# Altium project Hydra A1 UCLO 35131D.PrjPCB (part 5 of 14)
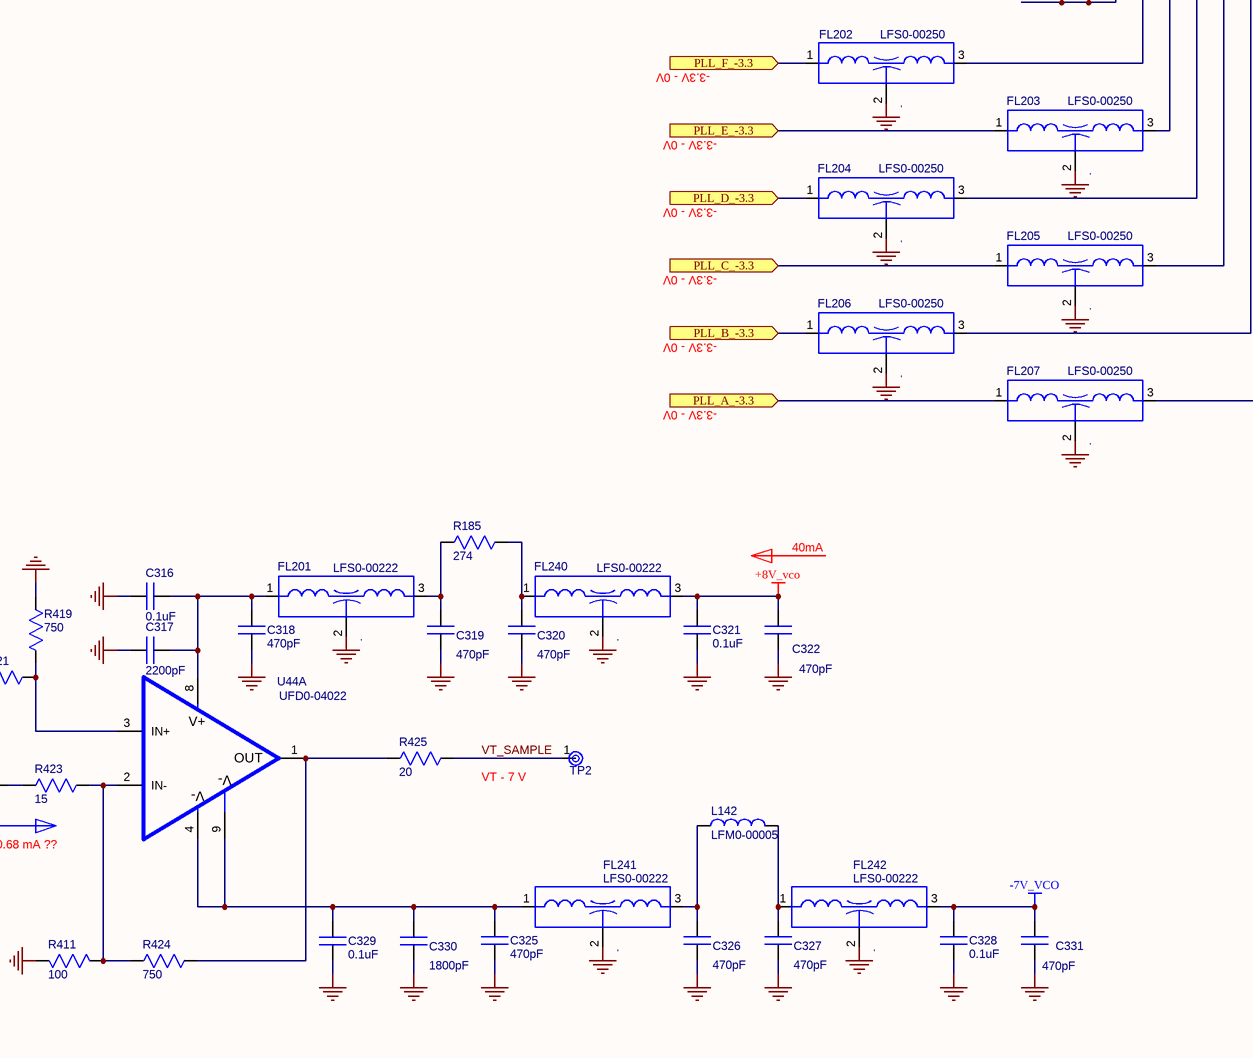
[diagram p72: Fast PLL.SchDoc, bottom right]

## Sheet Fast PLL.SchDoc: Fast PLL (continued)

### Parts
(Parts that share a designator on the sheet are numbered #1, #2 ... from top to bottom, then left to right.)
AT20  value 0dB  [ATTN-IMS-0805]  (hidden comment: PAD;CHIP;0dB;+/-.3dB;.08 x .05;50 OHM;FACE DOWN)
AT21  value 20dB  [PCAAW]  (hidden comment: PAD;CHIP;20dB;+.5/-4dB;.08 x .06;50 OHM;FACE DOWN)
C22  value 470pF  [CAP-0201-N]  (hidden comment: 470 PF,+/-5%;X7R;25V,CHIP;0201)
C23  value 470pF  [CAP-0402-N]  (hidden comment: 470 PF;5%;COG;>50V;CHIP;0402)
C26  value 470pF  [CAP-0402-N]  (hidden comment: 470 PF;5%;COG;>50V;CHIP;0402)
C27  value 0.1uF  [CAP-0402-N]  (hidden comment: .1 UF,10%;X7R;16V,CHIP;0402)
C30  value 470pF  [CAP-0402-N]  (hidden comment: 470 PF;5%;COG;>50V;CHIP;0402)
C31  value 470pF  [CAP-0402-N]  (hidden comment: 470 PF;5%;COG;>50V;CHIP;0402)
C32  value 470pF  [CAP-0402-N]  (hidden comment: 470 PF;5%;COG;>50V;CHIP;0402)
C33  value 1.5pF  [CAP-0402-RF]  (hidden comment: 1.5 PF;200V;.05PF;HIGH Q;SMT;CERAMIC;0402)
C34  value 1.8pF  [CAP-0402-RF]  (hidden comment: 1.8 PF;200V;.05PF;HIGH Q;SMT;CERAMIC;0402)
C35  value 8.2pF  [CAP-0402-RF]  (hidden comment: 8.2 PF;200V;.1PF;HIGH Q;SMT;CERAMIC;0402)
C36  value 1.5pF  [CAP-0402-RF]  (hidden comment: 1.5 PF;200V;.05PF;HIGH Q;SMT;CERAMIC;0402)
C37  value 1.8pF  [CAP-0402-RF]  (hidden comment: 1.8 PF;200V;.05PF;HIGH Q;SMT;CERAMIC;0402)
C38  value 8.2pF  [CAP-0402-RF]  (hidden comment: 8.2 PF;200V;.1PF;HIGH Q;SMT;CERAMIC;0402)
C39  value 1.5pF  [CAP-0402-RF]  (hidden comment: 1.5 PF;200V;.05PF;HIGH Q;SMT;CERAMIC;0402)
C40  value 1.2pF  [CAP-0402-RF]  (hidden comment: 1.2 PF;200V;.05PF;HIGH Q;SMT;CERAMIC;0402)
C41  value 9.1pF  [CAP-0402-RF]  (hidden comment: 9.1 PF;200V;.1PF;HIGH Q;SMT;CERAMIC;0402)
C42  value 470pF  [CAP-0402-N]  (hidden comment: 470 PF;5%;COG;>50V;CHIP;0402)
C43  value 0.1uF  [CAP-0402-N]  (hidden comment: .1 UF,10%;X7R;16V,CHIP;0402)
C44  value 0.1uF  [CAP-0402-N]  (hidden comment: .1 UF,10%;X7R;16V,CHIP;0402)
C45  value 6.8pF  [CAP-0402-RF]  (hidden comment: 6.8 PF;200V;.1PF;HIGH Q;SMT;CERAMIC;0402)
C46  value 1.8pF  [CAP-0402-RF]  (hidden comment: 1.8 PF;200V;.05PF;HIGH Q;SMT;CERAMIC;0402)
C47  value 9.1pF  [CAP-0402-RF]  (hidden comment: 9.1 PF;200V;.1PF;HIGH Q;SMT;CERAMIC;0402)
C48  value 6.8pF  [CAP-0402-RF]  (hidden comment: 6.8 PF;200V;.1PF;HIGH Q;SMT;CERAMIC;0402)
C49  value 1.2pF  [CAP-0402-RF]  (hidden comment: 1.2 PF;200V;.05PF;HIGH Q;SMT;CERAMIC;0402)
C50  value 1.2pF  [CAP-0402-RF]  (hidden comment: 1.2 PF;200V;.05PF;HIGH Q;SMT;CERAMIC;0402)
C52  value 1.5pF  [CAP-0402-RF]  (hidden comment: 1.5 PF;200V;.05PF;HIGH Q;SMT;CERAMIC;0402)
C53  value 1.5pF  [CAP-0402-RF]  (hidden comment: 1.5 PF;200V;.05PF;HIGH Q;SMT;CERAMIC;0402)
C54  value 0.6pF  [CAP-0402-RF]  (hidden comment: .6 PF;200V;.05PF;HIGH Q;SMT;CERAMIC;0402)
C55  value 0.6pF  [CAP-0402-RF]  (hidden comment: .6 PF;200V;.05PF;HIGH Q;SMT;CERAMIC;0402)
C56  value 0.6pF  [CAP-0402-RF]  (hidden comment: .6 PF;200V;.05PF;HIGH Q;SMT;CERAMIC;0402)
C57  value 0.8pF  [CAP-0402-RF]  (hidden comment: .8 PF;200V;.05PF;HIGH Q;SMT;CERAMIC;0402)
C58  value 0.6pF  [CAP-0402-RF]  (hidden comment: .6 PF;200V;.05PF;HIGH Q;SMT;CERAMIC;0402)
C68  value 0.1uF  [CAP-0402-N]  (hidden comment: .1 UF,10%;X7R;16V,CHIP;0402)
C75  value 470pF  [CAP-0402-N]  (hidden comment: 470 PF;5%;COG;>50V;CHIP;0402)
C92  value 0.1uF  [CAP-0402-N]  (hidden comment: .1 UF,10%;X7R;16V,CHIP;0402)
C98  value 470pF  [CAP-0402-N]  (hidden comment: 470 PF;5%;COG;>50V;CHIP;0402)
C99  value 0.1uF  [CAP-0402-N]  (hidden comment: .1 UF,10%;X7R;16V,CHIP;0402)
C127  value 0.1uF  [CAP-0402-N]  (hidden comment: .1 UF,10%;X7R;16V,CHIP;0402)
C161  value 27pF  [CAP-0201-N]  (hidden comment: 27 PF,5% TOL;C0G;50V,CHIP;0201)
C163  value 27pF  [CAP-0402-N]  (hidden comment: 27 PF;5%;COG;>50V;CHIP;0402)
C167  value 0.1uF, 50V  [CAP-0603-N]  (hidden comment: .1UF;5%;X7R;50V;CHIP;0603)
C168  value 470pF  [CAP-0201-N]  (hidden comment: 470 PF,+/-5%;X7R;25V,CHIP;0201)
C169  value 0.1uF  [CAP-0402-N]  (hidden comment: .1 UF,10%;X7R;16V,CHIP;0402)
C170  value 470pF  [CAP-0402-N]  (hidden comment: 470 PF;5%;COG;>50V;CHIP;0402)
C174  value 150pF  [CAP-0402-N]  (hidden comment: 150 PF;5%;COG;>50V;CHIP;0402)
C219  value 10pF  [CAP-0402-N]  (hidden comment: 10 PF;5%;COG;>50V;CHIP;0402)
C220  value 10pF  [CAP-0402-N]  (hidden comment: 10 PF;5%;COG;>50V;CHIP;0402)
C221  value 0.1uF  [CAP-0402-N]  (hidden comment: .1 UF,10%;X7R;16V,CHIP;0402)
C223  value 470pF  [CAP-0402-N]  (hidden comment: 470 PF;5%;COG;>50V;CHIP;0402)
C224  value 470pF  [CAP-0402-N]  (hidden comment: 470 PF;5%;COG;>50V;CHIP;0402)
C225  value 0.1uF  [CAP-0402-N]  (hidden comment: .1 UF,10%;X7R;16V,CHIP;0402)
C226  value 470pF  [CAP-0402-N]  (hidden comment: 470 PF;5%;COG;>50V;CHIP;0402)
C228  value 0.1uF  [CAP-0402-N]  (hidden comment: .1 UF,10%;X7R;16V,CHIP;0402)
C229  value 470pF  [CAP-0402-N]  (hidden comment: 470 PF;5%;COG;>50V;CHIP;0402)
C242  value 0.1uF, 50V  [CAP-0603-N]  (hidden comment: .1UF;5%;X7R;50V;CHIP;0603)
C243  value 1800pF  [CAP-0402-N]  (hidden comment: 1800 PF;5%;X7R>50V;CHIP;0402)
C244  value 470pF  [CAP-0402-N]  (hidden comment: 470 PF;5%;COG;>50V;CHIP;0402)
C246  value 470pF  [CAP-0402-N]  (hidden comment: 470 PF;5%;COG;>50V;CHIP;0402)
C247  value 0.3pF  [CAP-0402-RF]  (hidden comment: .3 PF 200V .05PF HIGH Q SMT 0402)
C248  value 0.2pF  [CAP-0402-RF]  (hidden comment: .2 PF;200V;.05PF;HIGH Q;SMT;CERAMIC;0402)
C249  value 0.3pF  [CAP-0402-RF]  (hidden comment: .3 PF 200V .05PF HIGH Q SMT 0402)
C250  value 0.2pF  [CAP-0402-RF]  (hidden comment: .2 PF;200V;.05PF;HIGH Q;SMT;CERAMIC;0402)
C251  value 1.0pF  [CAP-0201-N]  (hidden comment: 1.0pF;5%;COG;50V;CHIP;0201)
C262  value 0.1uF  [CAP-0402-N]  (hidden comment: .1 UF,10%;X7R;16V,CHIP;0402)
C263  value 0.1uF, 50V  [CAP-0603-N]  (hidden comment: .1UF;5%;X7R;50V;CHIP;0603)
C264  value 470pF  [CAP-0402-N]  (hidden comment: 470 PF;5%;COG;>50V;CHIP;0402)
C265  value 1800pF  [CAP-0402-N]  (hidden comment: 1800 PF;5%;X7R>50V;CHIP;0402)
C266  value 470pF  [CAP-0201-N]  (hidden comment: 470 PF,+/-5%;X7R;25V,CHIP;0201)
C267  value 1800pF  [CAP-0402-N]  (hidden comment: 1800 PF;5%;X7R>50V;CHIP;0402)
C268  value 470pF  [CAP-0201-N]  (hidden comment: 470 PF,+/-5%;X7R;25V,CHIP;0201)
C269  value 470pF  [CAP-0402-N]  (hidden comment: 470 PF;5%;COG;>50V;CHIP;0402)
C270  value 470pF  [CAP-0402-N]  (hidden comment: 470 PF;5%;COG;>50V;CHIP;0402)
C271  value 470pF  [CAP-0402-N]  (hidden comment: 470 PF;5%;COG;>50V;CHIP;0402)
C272  value 0.1uF, 50V  [CAP-0603-N]  (hidden comment: .1UF;5%;X7R;50V;CHIP;0603)
C273  value 470pF  [CAP-0402-N]  (hidden comment: 470 PF;5%;COG;>50V;CHIP;0402)
C274  value 0.2pF  [CAP-0402-RF]  (hidden comment: .2 PF;200V;.05PF;HIGH Q;SMT;CERAMIC;0402)
C275  value 0.1uF  [CAP-0402-N]  (hidden comment: .1 UF,10%;X7R;16V,CHIP;0402)
C276  value 1800pF  [CAP-0402-N]  (hidden comment: 1800 PF;5%;X7R>50V;CHIP;0402)
C277  value 470pF  [CAP-0201-N]  (hidden comment: 470 PF,+/-5%;X7R;25V,CHIP;0201)
C278  value 470pF  [CAP-0402-N]  (hidden comment: 470 PF;5%;COG;>50V;CHIP;0402)
C279  value 27pF  [CAP-0402-N]  (hidden comment: 27 PF;5%;COG;>50V;CHIP;0402)
C280  value 470pF  [CAP-0402-N]  (hidden comment: 470 PF;5%;COG;>50V;CHIP;0402)
C281  value 0.1uF  [CAP-0402-N]  (hidden comment: .1 UF,10%;X7R;16V,CHIP;0402)
C282  value 0.2pF  [CAP-0402-RF]  (hidden comment: .2 PF;200V;.05PF;HIGH Q;SMT;CERAMIC;0402)
C283  value 0.4pF  [CAP-0402-RF]  (hidden comment: .4 PF;200V;.05PF;HIGH Q;SMT;CERAMIC;0402)
C284  value 0.2pF  [CAP-0402-RF]  (hidden comment: .2 PF;200V;.05PF;HIGH Q;SMT;CERAMIC;0402)
C285  value 0.4pF  [CAP-0402-RF]  (hidden comment: .4 PF;200V;.05PF;HIGH Q;SMT;CERAMIC;0402)
C286  value 27pF  [CAP-0402-N]  (hidden comment: 27 PF;5%;COG;>50V;CHIP;0402)
C287  value 470pF  [CAP-0402-N]  (hidden comment: 470 PF;5%;COG;>50V;CHIP;0402)
C288  value 0.1uF  [CAP-0402-N]  (hidden comment: .1 UF,10%;X7R;16V,CHIP;0402)
C289  value 470pF  [CAP-0402-N]  (hidden comment: 470 PF;5%;COG;>50V;CHIP;0402)
C290  value 470pF  [CAP-0603-N]  (hidden comment: 470 PF;5%;COG;>50V;CHIP;0603)
C291  value 470pF  [CAP-0402-N]  (hidden comment: 470 PF;5%;COG;>50V;CHIP;0402)
C292  value 0.1uF, 50V  [CAP-0603-N]  (hidden comment: .1UF;5%;X7R;50V;CHIP;0603)
C293  value 0.1uF  [CAP-0603-H035-N]  (hidden comment: .1UF;10%;X7R;16V;CHIP;0603)
C294  value 470pF  [CAP-0201-N]  (hidden comment: 470 PF,+/-5%;X7R;25V,CHIP;0201)
C295  value 1.0pF  [CAP-0201-N]  (hidden comment: 1.0pF;5%;COG;50V;CHIP;0201)
C296  value 1800pF  [CAP-0402-N]  (hidden comment: 1800 PF;5%;X7R>50V;CHIP;0402)
C297  value 0.1uF  [CAP-0402-N]  (hidden comment: .1 UF,10%;X7R;16V,CHIP;0402)
C298  value 0.1uF  [CAP-0402-N]  (hidden comment: .1 UF,10%;X7R;16V,CHIP;0402)
C299  value 470pF  [CAP-0402-N]  (hidden comment: 470 PF;5%;COG;>50V;CHIP;0402)
C300  value 470pF  [CAP-0402-N]  (hidden comment: 470 PF;5%;COG;>50V;CHIP;0402)
C302  value 470pF  [CAP-0402-N]  (hidden comment: 470 PF;5%;COG;>50V;CHIP;0402)
C303  value 470pF  [CAP-0201-N]  (hidden comment: 470 PF,+/-5%;X7R;25V,CHIP;0201)
C304  value 470pF  [CAP-0402-N]  (hidden comment: 470 PF;5%;COG;>50V;CHIP;0402)
C305  value 0.1uF, 50V  [CAP-0603-N]  (hidden comment: .1UF;5%;X7R;50V;CHIP;0603)
C306  value 0.1uF  [CAP-0402-N]  (hidden comment: .1 UF,10%;X7R;16V,CHIP;0402)
C307  value 0.1uF  [CAP-0402-N]  (hidden comment: .1 UF,10%;X7R;16V,CHIP;0402)
C308  value 2200pF  [CAP-0201-N]  (hidden comment: 2200 PF,+/-5%;X7R;25V,CHIP;0201)
C309  value 2200pF  [CAP-0201-N]  (hidden comment: 2200 PF,+/-5%;X7R;25V,CHIP;0201)
C310  value 0.1uF  [CAP-0402-N]  (hidden comment: .1 UF,10%;X7R;16V,CHIP;0402)
C311  value 0.1uF  [CAP-0402-N]  (hidden comment: .1 UF,10%;X7R;16V,CHIP;0402)
C312  value 2200pF  [CAP-0201-N]  (hidden comment: 2200 PF,+/-5%;X7R;25V,CHIP;0201)
C313  value 470pF  [CAP-0402-N]  (hidden comment: 470 PF;5%;COG;>50V;CHIP;0402)
C314  value 470pF  [CAP-0402-N]  (hidden comment: 470 PF;5%;COG;>50V;CHIP;0402)
C315  value 0.1uF  [CAP-0402-N]  (hidden comment: .1 UF,10%;X7R;16V,CHIP;0402)
C316  value 0.1uF  [CAP-0402-N]  (hidden comment: .1 UF,10%;X7R;16V,CHIP;0402)
C317  value 2200pF  [CAP-0201-N]  (hidden comment: 2200 PF,+/-5%;X7R;25V,CHIP;0201)
C318  value 470pF  [CAP-0201-N]  (hidden comment: 470 PF,+/-5%;X7R;25V,CHIP;0201)
C319  value 470pF  [CAP-0402-N]  (hidden comment: 470 PF;5%;COG;>50V;CHIP;0402)
C320  value 470pF  [CAP-0402-N]  (hidden comment: 470 PF;5%;COG;>50V;CHIP;0402)
C321  value 0.1uF  [CAP-0402-N]  (hidden comment: .1 UF,10%;X7R;16V,CHIP;0402)
C322  value 470pF  [CAP-0402-N]  (hidden comment: 470 PF;5%;COG;>50V;CHIP;0402)
C323  value 0.1uF  [CAP-0402-N]  (hidden comment: .1 UF,10%;X7R;16V,CHIP;0402)
C325  value 470pF  [CAP-0201-N]  (hidden comment: 470 PF,+/-5%;X7R;25V,CHIP;0201)
C326  value 470pF  [CAP-0402-N]  (hidden comment: 470 PF;5%;COG;>50V;CHIP;0402)
C327  value 470pF  [CAP-0402-N]  (hidden comment: 470 PF;5%;COG;>50V;CHIP;0402)
C328  value 0.1uF  [CAP-0402-N]  (hidden comment: .1 UF,10%;X7R;16V,CHIP;0402)
C329  value 0.1uF  [CAP-0402-N]  (hidden comment: .1 UF,10%;X7R;16V,CHIP;0402)
C330  value 1800pF  [CAP-0402-N]  (hidden comment: 1800 PF;5%;X7R>50V;CHIP;0402)
C331  value 470pF  [CAP-0402-N]  (hidden comment: 470 PF;5%;COG;>50V;CHIP;0402)
C332  value 8.2pF  [CAP-0402-RF]  (hidden comment: 8.2 PF;200V;.1PF;HIGH Q;SMT;CERAMIC;0402)
C333  value 1.2pF  [CAP-0402-RF]  (hidden comment: 1.2 PF;200V;.05PF;HIGH Q;SMT;CERAMIC;0402)
C334  value 6.8pF  [CAP-0402-RF]  (hidden comment: 6.8 PF;200V;.1PF;HIGH Q;SMT;CERAMIC;0402)
C335  value 1.8pF  [CAP-0402-RF]  (hidden comment: 1.8 PF;200V;.05PF;HIGH Q;SMT;CERAMIC;0402)
C336  value 8.2pF  [CAP-0402-RF]  (hidden comment: 8.2 PF;200V;.1PF;HIGH Q;SMT;CERAMIC;0402)
C337  value 1.5pF  [CAP-0402-RF]  (hidden comment: 1.5 PF;200V;.05PF;HIGH Q;SMT;CERAMIC;0402)
C338  value 0.8pF  [CAP-0402-RF]  (hidden comment: .8 PF;200V;.05PF;HIGH Q;SMT;CERAMIC;0402)
C339  value 0.6pF  [CAP-0402-RF]  (hidden comment: .6 PF;200V;.05PF;HIGH Q;SMT;CERAMIC;0402)
C362  value 0.1uF  [CAP-0402-N]  (hidden comment: .1 UF,10%;X7R;16V,CHIP;0402)
C363  value 470pF  [CAP-0402-N]  (hidden comment: 470 PF;5%;COG;>50V;CHIP;0402)
C364  value 27pF  [CAP-0201-N]  (hidden comment: 27 PF,5% TOL;C0G;50V,CHIP;0201)
C383  value 470pF  [CAP-0201-N]  (hidden comment: 470 PF,+/-5%;X7R;25V,CHIP;0201)
C384  value 470pF  [CAP-0201-N]  (hidden comment: 470 PF,+/-5%;X7R;25V,CHIP;0201)
C386  value 470pF  [CAP-0201-N]  (hidden comment: 470 PF,+/-5%;X7R;25V,CHIP;0201)
C397  value 27pF  [CAP-0201-N]  (hidden comment: 27 PF,5% TOL;C0G;50V,CHIP;0201)
C404  value 470pF  [CAP-0201-N]  (hidden comment: 470 PF,+/-5%;X7R;25V,CHIP;0201)
C405  value 470pF  [CAP-0201-N]  (hidden comment: 470 PF,+/-5%;X7R;25V,CHIP;0201)
C406  value 27pF  [CAP-0402-N]  (hidden comment: 27 PF;5%;COG;>50V;CHIP;0402)
C407  value 27pF  [CAP-0402-N]  (hidden comment: 27 PF;5%;COG;>50V;CHIP;0402)
C408  value 27pF  [CAP-0402-N]  (hidden comment: 27 PF;5%;COG;>50V;CHIP;0402)
C409  value 27pF  [CAP-0402-N]  (hidden comment: 27 PF;5%;COG;>50V;CHIP;0402)
C410  value 0.1uF, 50V  [CAP-0603-N]  (hidden comment: .1UF;5%;X7R;50V;CHIP;0603)
C411  value 0.1uF, 50V  [CAP-0603-N]  (hidden comment: .1UF;5%;X7R;50V;CHIP;0603)
C412  .  value 470pF  [CAP-0402-N]
C413  value 0.1uF, 50V  [CAP-0603-N]  (hidden comment: .1UF;5%;X7R;50V;CHIP;0603)
C414  value 470pF  [CAP-0402-N]  (hidden comment: 470 PF;5%;COG;>50V;CHIP;0402)
C415  value 470pF  [CAP-0402-N]  (hidden comment: 470 PF;5%;COG;>50V;CHIP;0402)
C416  value 0.1uF  [CAP-0603-H035-N]  (hidden comment: .1UF;10%;X7R;16V;CHIP;0603)
C417  value 470pF  [CAP-0402-N]  (hidden comment: 470 PF;5%;COG;>50V;CHIP;0402)
C418  value 27pF  [CAP-0402-N]  (hidden comment: 27 PF;5%;COG;>50V;CHIP;0402)
C442  value 470pF  [CAP-0201-N]  (hidden comment: 470 PF,+/-5%;X7R;25V,CHIP;0201)
C443  value 470pF  [CAP-0201-N]  (hidden comment: 470 PF,+/-5%;X7R;25V,CHIP;0201)
C444  value 470pF  [CAP-0201-N]  (hidden comment: 470 PF,+/-5%;X7R;25V,CHIP;0201)
C455  value 470pF  [CAP-0201-N]  (hidden comment: 470 PF,+/-5%;X7R;25V,CHIP;0201)
C456  value 470pF  [CAP-0201-N]  (hidden comment: 470 PF,+/-5%;X7R;25V,CHIP;0201)
C457  value 470pF  [CAP-0201-N]  (hidden comment: 470 PF,+/-5%;X7R;25V,CHIP;0201)
C458  value 0.1uF  [CAP-0402-N]  (hidden comment: .1 UF,10%;X7R;16V,CHIP;0402)
C459  value 0.1uF  [CAP-0402-N]  (hidden comment: .1 UF,10%;X7R;16V,CHIP;0402)
C460  value 0.1uF, 50V  [CAP-0603-N]  (hidden comment: .1UF;5%;X7R;50V;CHIP;0603)
C461  value 470pF  [CAP-0201-N]  (hidden comment: 470 PF,+/-5%;X7R;25V,CHIP;0201)
C462  value 470pF  [CAP-0402-N]  (hidden comment: 470 PF;5%;COG;>50V;CHIP;0402)
C463  value 470pF  [CAP-0402-N]  (hidden comment: 470 PF;5%;COG;>50V;CHIP;0402)
C464  value 470pF  [CAP-0402-N]  (hidden comment: 470 PF;5%;COG;>50V;CHIP;0402)
C465  value 470pF  [CAP-0402-N]  (hidden comment: 470 PF;5%;COG;>50V;CHIP;0402)
C466  value 0.1uF, 50V  [CAP-0603-N]  (hidden comment: .1UF;5%;X7R;50V;CHIP;0603)
C467  value 470pF  [CAP-0402-N]  (hidden comment: 470 PF;5%;COG;>50V;CHIP;0402)
C468  value 0.1uF  [CAP-0402-N]  (hidden comment: .1 UF,10%;X7R;16V,CHIP;0402)
C469  5 uA  value 470pF  [CAP-0402-N]
C470  value 0.1uF  [CAP-0402-N]  (hidden comment: .1 UF,10%;X7R;16V,CHIP;0402)
C471  value 470pF  [CAP-0402-N]  (hidden comment: 470 PF;5%;COG;>50V;CHIP;0402)
C830  value 2.7pF  [CAP-0201-N]  (hidden comment: 2.7pF;5%;COG;50V;CHIP;0201)
C1101  value 27pF  [CAP-0201-N]  (hidden comment: 27 PF,5% TOL;C0G;50V,CHIP;0201)
C1208  value 1uF  [CAP-1210-N]  (hidden comment: 1UF; 20%; 16V; PPS FILM; SMT; 1210)
C1209  value 0.1uF, 50V  [CAP-0603-N]  (hidden comment: .1UF;5%;X7R;50V;CHIP;0603)
C1210  value 0.1uF  [CAP-0402-N]  (hidden comment: .1 UF,10%;X7R;16V,CHIP;0402)
C1211  value 33uF 35V  [CAPP-7343-31-N]  (hidden comment: 33 UF;20%;35V;.07 OHM ESR;7343-31)
C1212  value 33uF 35V  [CAPP-7343-31-N]  (hidden comment: 33 UF;20%;35V;.07 OHM ESR;7343-31)
C1213  value 0.1uF  [CAP-0603-H035-N]  (hidden comment: .1UF;10%;X7R;16V;CHIP;0603)
C1238  value 0.1uF  [CAP-0603-H035-N]  (hidden comment: .1UF;10%;X7R;16V;CHIP;0603)
C1239  value 470pF  [CAP-0402-N]  (hidden comment: 470 PF;5%;COG;>50V;CHIP;0402)
CR20  DSA2-02812  [SOT23-N]  (parts A,B of 2)
FL14  Filter EMI 2200PF,1206  [FIL-NFE31P-1206-4P]  (value not drawn)
FL19  Filter EMI 2200PF,1206  [FIL-NFE31P-1206-4P]  (value not drawn)
FL20  Filter EMI 2200PF,1206  [FIL-NFE31P-1206-4P]  (value not drawn)
FL26  Filter EMI 2200PF,1206  [FIL-NFE31P-1206-4P]  (value not drawn)
FL135  F/T FILTER;CHIP;2.5 DCR150MA;16V;T LC;25PF;200MHz;0603  [FIL-NFL18ST]  (value not drawn)
FL136  NFM18CC222R1C3  [FIL-NFL18C]  (value not drawn)
FL139  NFM18CC222R1C3  [FIL-NFL18C]  (value not drawn)
FL140  Filter EMI 2200PF,1206  [FIL-NFE31P-1206-4P]  (value not drawn)
FL154  Filter EMI 2200PF,1206  [FIL-NFE31P-1206-4P]  (value not drawn)
FL160  F/T FILTER;CHIP;2.5 DCR150MA;16V;T LC;25PF;200MHz;0603  [FIL-NFL18ST]  (value not drawn)
FL167  F/T FILTER;CHIP;2.5 DCR150MA;16V;T LC;25PF;200MHz;0603  [FIL-NFL18ST]  (value not drawn)
FL169  Filter EMI 2200PF,1206  [FIL-NFE31P-1206-4P]  (value not drawn)
FL178  NFM18CC222R1C3  [FIL-NFL18C]  (value not drawn)
FL179  Filter EMI 2200PF,1206  [FIL-NFE31P-1206-4P]  (value not drawn)
FL180  Filter EMI 2200PF,1206  [FIL-NFE31P-1206-4P]  (value not drawn)
FL181  Filter EMI 2200PF,1206  [FIL-NFE31P-1206-4P]  (value not drawn)
FL182  F/T FILTER;CHIP;2.5 DCR150MA;16V;T LC;25PF;200MHz;0603  [FIL-NFL18ST]  (value not drawn)
FL183  NFM18CC222R1C3  [FIL-NFL18C]  (value not drawn)
FL191  F/T FILTER;CHIP;2.5 DCR150MA;16V;T LC;25PF;200MHz;0603  [FIL-NFL18ST]  (value not drawn)
FL192  F/T FILTER;CHIP;2.5 DCR150MA;16V;T LC;25PF;200MHz;0603  [FIL-NFL18ST]  (value not drawn)
FL195  Filter EMI 2200PF,1206  [FIL-NFE31P-1206-4P]  (value not drawn)
FL197  F/T FILTER;CHIP;2.5 DCR150MA;16V;T LC;25PF;200MHz;0603  [FIL-NFL18ST]  (value not drawn)
FL198  Filter EMI 2200PF,1206  [FIL-NFE31P-1206-4P]  (value not drawn)
FL199  NFM18CC222R1C3  [FIL-NFL18C]  (value not drawn)
FL200  NFM18CC222R1C3  [FIL-NFL18C]  (value not drawn)
FL201  Filter EMI 2200PF,1206  [FIL-NFE31P-1206-4P]  (value not drawn)
FL202  F/T FILTER;CHIP;2.5 DCR150MA;16V;T LC;25PF;200MHz;0603  [FIL-NFL18ST]  (value not drawn)
FL203  F/T FILTER;CHIP;2.5 DCR150MA;16V;T LC;25PF;200MHz;0603  [FIL-NFL18ST]  (value not drawn)
FL204  F/T FILTER;CHIP;2.5 DCR150MA;16V;T LC;25PF;200MHz;0603  [FIL-NFL18ST]  (value not drawn)
FL205  F/T FILTER;CHIP;2.5 DCR150MA;16V;T LC;25PF;200MHz;0603  [FIL-NFL18ST]  (value not drawn)
FL206  F/T FILTER;CHIP;2.5 DCR150MA;16V;T LC;25PF;200MHz;0603  [FIL-NFL18ST]  (value not drawn)
FL207  F/T FILTER;CHIP;2.5 DCR150MA;16V;T LC;25PF;200MHz;0603  [FIL-NFL18ST]  (value not drawn)
FL208  F/T FILTER;CHIP;2.5 DCR150MA;16V;T LC;25PF;200MHz;0603  [FIL-NFL18ST]  (value not drawn)
FL209  F/T FILTER;CHIP;2.5 DCR150MA;16V;T LC;25PF;200MHz;0603  [FIL-NFL18ST]  (value not drawn)
FL240  Filter EMI 2200PF,1206  [FIL-NFE31P-1206-4P]  (value not drawn)
FL241  Filter EMI 2200PF,1206  [FIL-NFE31P-1206-4P]  (value not drawn)
FL242  Filter EMI 2200PF,1206  [FIL-NFE31P-1206-4P]  (value not drawn)
FL243  NFM18CC222R1C3  [FIL-NFL18C]  (value not drawn)
FL246  M_PN: HFCN-880+  [FV1206]  (hidden comment: FILTER;HI PASS;880MHz;7SEC;FV1206;RoHS)
FL247  M_PN: LFCN-1800+  [FV1206]  (hidden comment: FILTER;LOW PASS;1800MHZ;7SECTIONS;10W;FV1206;RoHS)
FL248  Filter EMI 2200PF,1206  [FIL-NFE31P-1206-4P]  (value not drawn)
FL249  Filter EMI 2200PF,1206  [FIL-NFE31P-1206-4P]  (value not drawn)
FL250  Filter EMI 2200PF,1206  [FIL-NFE31P-1206-4P]  (value not drawn)
FL251  Filter EMI 2200PF,1206  [FIL-NFE31P-1206-4P]  (value not drawn)
FL252  Filter EMI 2200PF,1206  [FIL-NFE31P-1206-4P]  (value not drawn)
FL253  Filter EMI 2200PF,1206  [FIL-NFE31P-1206-4P]  (value not drawn)
FL254  Filter EMI 2200PF,1206  [FIL-NFE31P-1206-4P]  (value not drawn)
FL255  Filter EMI 2200PF,1206  [FIL-NFE31P-1206-4P]  (value not drawn)
FL295  F/T FILTER;CHIP;2.5 DCR150MA;16V;T LC;25PF;200MHz;0603  [FIL-NFL18ST]  (value not drawn)
FT2  FastPLL  NoLoad: N/L  [FromToNode_ML2]  (net tie, no BOM)
FT3  FastPLL  NoLoad: N/L  [FromToNode_ML2]  (net tie, no BOM)
FT13  FastPLL  NoLoad: N/L  [FromToNode_ML5]  (net tie, no BOM)
FT27  FastPLL  NoLoad: N/L  [FromToNode_ML2]  (net tie, no BOM)
FT29  FastPLL  NoLoad: N/L  [FromToNode_ML2]  (net tie, no BOM)
L21  EMI FILTER;CHIP;330 OHMS@100MHZ;0.5A;0.30 DCR;0603  [BLM18A_Murata]  (value not drawn)
L22  EMI FILTER;CHIP;330 OHMS@100MHZ;0.5A;0.30 DCR;0603  [BLM18A_Murata]  (value not drawn)
L23  value 8.7nH  [IND-0603HP]  (hidden comment: INDUCTOR;8.7NH;2%;5.5G SRF;149Q @1.7G;.054 DCR;1.4A;0603)
L24  value 15nH  [IND-0603HP]  (hidden comment: INDUCTOR;15NH;2%;3.6G SRF;83Q @0.9G;.054 DCR;1.2A;0603)
L25  value 8.2nH  [IND-0603HP]  (hidden comment: INDUCTOR;8.2NH;2%;5.9G SRF;148Q @1.7G;.054 DCR;1.4A;0603)
L26  value 8.7nH  [IND-0603HP]  (hidden comment: INDUCTOR;8.7NH;2%;5.5G SRF;149Q @1.7G;.054 DCR;1.4A;0603)
L27  value 15nH  [IND-0603HP]  (hidden comment: INDUCTOR;15NH;2%;3.6G SRF;83Q @0.9G;.054 DCR;1.2A;0603)
L28  value 8.2nH  [IND-0603HP]  (hidden comment: INDUCTOR;8.2NH;2%;5.9G SRF;148Q @1.7G;.054 DCR;1.4A;0603)
L29  value 6.8nH  [IND-0603HP]  (hidden comment: INDUCTOR;6.8NH;2%;5.8G SRF;143Q @1.7G;.042 DCR;1.4A;0603)
L30  value 6.8nH  [IND-0603HP]  (hidden comment: INDUCTOR;6.8NH;2%;5.8G SRF;143Q @1.7G;.042 DCR;1.4A;0603)
L31  value 150nH  [IND-0603HP]  (hidden comment: INDUCTOR;150NH;2%;1.35G SRF;188Q @0.9G;.082 DCR;.39A;0603)
L32  value 75nH  [IND-0603HP]  (hidden comment: INDUCTOR;75NH;2%;1.9G SRF;71Q @0.9G;.52 DCR;.5A;0603)
L33  value 27nH  [IND-0603HP]  (hidden comment: INDUCTOR;27NH;2%;2.8G SRF;74Q @0.9G;.150DCR;.78A;0603)
L34  value 150nH  [IND-0603HP]  (hidden comment: INDUCTOR;150NH;2%;1.35G SRF;188Q @0.9G;.082 DCR;.39A;0603)
L35  value 75nH  [IND-0603HP]  (hidden comment: INDUCTOR;75NH;2%;1.9G SRF;71Q @0.9G;.52 DCR;.5A;0603)
L36  value 27nH  [IND-0603HP]  (hidden comment: INDUCTOR;27NH;2%;2.8G SRF;74Q @0.9G;.150DCR;.78A;0603)
L37  value 150nH  [IND-0603HP]  (hidden comment: INDUCTOR;150NH;2%;1.35G SRF;188Q @0.9G;.082 DCR;.39A;0603)
L38  value 75nH  [IND-0603HP]  (hidden comment: INDUCTOR;75NH;2%;1.9G SRF;71Q @0.9G;.52 DCR;.5A;0603)
L39  EMI FILTER;CHIP;330 OHMS@100MHZ;0.5A;0.30 DCR;0603  [BLM18A_Murata]  (value not drawn)
L40  EMI FILTER;CHIP;330 OHMS@100MHZ;0.5A;0.30 DCR;0603  [BLM18A_Murata]  (value not drawn)
L44  EMI FILTER;CHIP;330 OHMS@100MHZ;0.5A;0.30 DCR;0603  [BLM18A_Murata]  (value not drawn)
L45  EMI FILTER;CHIP;330 OHMS@100MHZ;0.5A;0.30 DCR;0603  [BLM18A_Murata]  (value not drawn)
L49  EMI FILTER;CHIP;330 OHMS@100MHZ;0.5A;0.30 DCR;0603  [BLM18A_Murata]  (value not drawn)
L50  EMI FILTER;CHIP;330 OHMS@100MHZ;0.5A;0.30 DCR;0603  [BLM18A_Murata]  (value not drawn)
L119  EMI FILTER;CHIP;330 OHMS@100MHZ;0.5A;0.30 DCR;0603  [BLM18A_Murata]  (value not drawn)
L120  value 5.6nH  [IND-0402HP]  (hidden comment: INDUCTOR;5.6NH;2%;6.6GHZ SRF;105Q @1.7GHZ;.048 DCR;1.6A;0402)
L121  value 5.6nH  [IND-0402HP]  (hidden comment: INDUCTOR;5.6NH;2%;6.6GHZ SRF;105Q @1.7GHZ;.048 DCR;1.6A;0402)
L129  value 5.6nH  [IND-0402HP]  (hidden comment: INDUCTOR;5.6NH;2%;6.6GHZ SRF;105Q @1.7GHZ;.048 DCR;1.6A;0402)
L130  value 5.6nH  [IND-0402HP]  (hidden comment: INDUCTOR;5.6NH;2%;6.6GHZ SRF;105Q @1.7GHZ;.048 DCR;1.6A;0402)
L131  EMI FILTER;CHIP;330 OHMS@100MHZ;0.5A;0.30 DCR;0603  [BLM18A_Murata]  (value not drawn)
L132  EMI FILTER;CHIP;330 OHMS@100MHZ;0.5A;0.30 DCR;0603  [BLM18A_Murata]  (value not drawn)
L133  value 5.6nH  [IND-0402HP]  (hidden comment: INDUCTOR;5.6NH;2%;6.6GHZ SRF;105Q @1.7GHZ;.048 DCR;1.6A;0402)
L134  value 5.6nH  [IND-0402HP]  (hidden comment: INDUCTOR;5.6NH;2%;6.6GHZ SRF;105Q @1.7GHZ;.048 DCR;1.6A;0402)
L135  value 5.6nH  [IND-0402HP]  (hidden comment: INDUCTOR;5.6NH;2%;6.6GHZ SRF;105Q @1.7GHZ;.048 DCR;1.6A;0402)
L136  value 5.6nH  [IND-0402HP]  (hidden comment: INDUCTOR;5.6NH;2%;6.6GHZ SRF;105Q @1.7GHZ;.048 DCR;1.6A;0402)
L137  EMI FILTER;CHIP;330 OHMS@100MHZ;0.5A;0.30 DCR;0603  [BLM18A_Murata]  (value not drawn)
L139  EMI FILTER;CHIP;330 OHMS@100MHZ;0.5A;0.30 DCR;0603  [BLM18A_Murata]  (value not drawn)
L140  EMI FILTER;CHIP;330 OHMS@100MHZ;0.5A;0.30 DCR;0603  [BLM18A_Murata]  (value not drawn)
L142  EMI FILTER;CHIP;330 OHMS@100MHZ;0.5A;0.30 DCR;0603  [BLM18A_Murata]  (value not drawn)
L143  value 15nH  [IND-0603HP]  (hidden comment: INDUCTOR;15NH;2%;3.6G SRF;83Q @0.9G;.054 DCR;1.2A;0603)
L144  value 8.2nH  [IND-0603HP]  (hidden comment: INDUCTOR;8.2NH;2%;5.9G SRF;148Q @1.7G;.054 DCR;1.4A;0603)
L145  value 18nH  [IND-0603HP]  (hidden comment: INDUCTOR;18NH;2%;3.3G SRF;76Q @0.9G;.066 DCR;1.2A;0603)
L146  value 18nH  [IND-0603HP]  (hidden comment: INDUCTOR;18NH;2%;3.3G SRF;76Q @0.9G;.066 DCR;1.2A;0603)
L163  EMI FILTER;CHIP;330 OHMS@100MHZ;0.5A;0.30 DCR;0603  [BLM18A_Murata]  (value not drawn)
L172  value 100nH  [IND-0603CS]  (hidden comment: INDUCTOR;100NH;5%;1.4GHZ SRF;34Q;.58 DCR;400MA;WIREWOUND;0603)
L173  EMI FILTER;CHIP;330 OHMS@100MHZ;0.5A;0.30 DCR;0603  [BLM18A_Murata]  (value not drawn)
L255  value 22nH  [IND-0402HP]  (hidden comment: INDUCTOR;22NH;2%;3.3GHZ SRF;74Q @1.7GHZ;0.160 DCR;0.8A;0402)
MTG35  NoLoad: N/L  [MHP200X92]
MTG62  NoLoad: N/L  [MHP200X92]
MTG63  NoLoad: N/L  [MHP200X92]
MTG64  NoLoad: N/L  [MHP200X92]
MTG65  NoLoad: N/L  [MHP200X92]
MTG66  NoLoad: N/L  [MHP200X92]
MTG73  NoLoad: N/L  [MHP200X92]
MTG78  NoLoad: N/L  [MHP200X92]
MTG79  NoLoad: N/L  [MHP200X92]
MTG96  NoLoad: N/L  [MHP200X92]
MTG103#2  NoLoad: N/L  [MHP150X67]
MTG109  NoLoad: N/L  [MHP150X67]
MTG117  NoLoad: N/L  [MHP200X92]
MTG118  NoLoad: N/L  [MHP200X92]
MTG119  NoLoad: N/L  [MHP200X92]
MTG120  NoLoad: N/L  [MHP200X92]
MTG121  NoLoad: N/L  [MHP200X92]
MTG122  NoLoad: N/L  [MHP200X92]
MTG123  NoLoad: N/L  [MHP200X92]
MTG124  NoLoad: N/L  [MHP200X92]
MTG125  NoLoad: N/L  [MHP200X92]
MTG126  NoLoad: N/L  [MHP200X92]
MTG127  NoLoad: N/L  [MHP200X92]
MTG128  NoLoad: N/L  [MHP200X92]
MTG129  NoLoad: N/L  [MHP200X92]
MTG130  NoLoad: N/L  [MHP200X92]
MTG131  NoLoad: N/L  [MHP200X92]
MTG132  NoLoad: N/L  [MHP200X92]
MTG133  NoLoad: N/L  [MHP200X92]
MTG134  NoLoad: N/L  [MHP200X92]
MTG135  NoLoad: N/L  [MHP200X92]
MTG136  NoLoad: N/L  [MHP200X92]
MTG137  NoLoad: N/L  [MHP200X92]
MTG138  NoLoad: N/L  [MHP200X92]
MTG139  NoLoad: N/L  [MHP200X92]
MTG140  NoLoad: N/L  [MHP200X92]
MTG141  NoLoad: N/L  [MHP200X92]
MTG142  NoLoad: N/L  [MHP200X92]
MTG143  NoLoad: N/L  [MHP200X92]
MTG144  NoLoad: N/L  [MHP200X92]
MTG145  NoLoad: N/L  [MHP200X92]
MTG146  NoLoad: N/L  [MHP200X92]
MTG173  NoLoad: N/L  [MHP200X92]
MTG174  NoLoad: N/L  [MHP200X92]
MTG175  NoLoad: N/L  [MHP200X92]
MTG176  NoLoad: N/L  [MHP200X92]
MTG177  NoLoad: N/L  [MHP200X92]
Q3  MMBT3904LT1  [SOT23-N]  (value not drawn)
R16  value 0  [RES-0603-N]  (hidden comment: JUMPER;.05 OHMS MAX;1A MAX;0603)
R56  value 22.1  [RES-0201-N]  (hidden comment: 22.1 OHMS;.05W;1%;200PPM;FILM CHIP;0201)
R63  NoLoad: N/L  [RES-0201-N]  (hidden comment: RES;CHIP,0.05 ohms max;1A max;0201)
R108  value 15  [RES-0402-N]  (hidden comment: 15 OHMS;.06W;1%;200PPM;FILM;CHIP;0402)
R172  value 0  [RES-0603-N]  (hidden comment: JUMPER;.05 OHMS MAX;1A MAX;0603)
R173  value 0  [RES-0603-N]  (hidden comment: JUMPER;.05 OHMS MAX;1A MAX;0603)
R174  value 0  [RES-0603-N]  (hidden comment: JUMPER;.05 OHMS MAX;1A MAX;0603)
R175  value 0  [RES-0603-N]  (hidden comment: JUMPER;.05 OHMS MAX;1A MAX;0603)
R176  value 0  [RES-0603-N]  (hidden comment: JUMPER;.05 OHMS MAX;1A MAX;0603)
R177  value 0  [RES-0603-N]  (hidden comment: JUMPER;.05 OHMS MAX;1A MAX;0603)
R185  value 274  [RES-0603-N]  (hidden comment: 274 OHMS;.1W;1%;100PPM;FILM;CHIP;0603)
R254  value 309  [RES-0402-N]  (hidden comment: 309 OHMS; 1%; .1W; 100PPM; FILM; CHIP; 0402)
R270  value 20  [RES-0402-N]  (hidden comment: 20 OHMS;.06W;1%;200PPM;FILM;CHIP;0402)
R271  value 20  [RES-0201-N]  (hidden comment: 20 OHMS;.05W;1%;200PPM;FILM CHIP;0201)
R272  value 750  [RES-0201-N]  (hidden comment: 750 OHMS;.05W;1%;100PPM;FILM CHIP;0201)
R273  value 100  [RES-0201-N]  (hidden comment: 100 OHMS;.05W;1%;100PPM;FILM CHIP;0201)
R274  value 200  [RES-0201-N]  (hidden comment: 200 OHMS;.05W;1%;100PPM;FILM CHIP;0201)
R276  value 27.4  [RES-0201-N]  (hidden comment: 27.4 OHMS;.05W;1%;200PPM;FILM CHIP;0201)
R280  value 200  [RES-0201-N]  (hidden comment: 200 OHMS;.05W;1%;100PPM;FILM CHIP;0201)
R285  value 200  [RES-0201-N]  (hidden comment: 200 OHMS;.05W;1%;100PPM;FILM CHIP;0201)
R286  value 453  [RES-0603-N]  (hidden comment: 453 OHMS;.06W;1%;100PPM;FILM;CHIP;0603)
R287  value 0 ohm  [RES-0201-N]  (hidden comment: RES;CHIP,0.05 ohms max;1A max;0201)
R288  value 17.4  [RES-0402-N]  (hidden comment: 17.4 OHMS;.06W;1%;200PPM;FILM;CHIP;0402)
R290  value 750  [RES-0201-N]  (hidden comment: 750 OHMS;.05W;1%;100PPM;FILM CHIP;0201)
R329  value 1.5K  [RES-0201-N]  (hidden comment: 1.5 KOHMS;.05W;1%;100PPM;FILM CHIP;0201)
R330  value 1.5K  [RES-0201-N]  (hidden comment: 1.5 KOHMS;.05W;1%;100PPM;FILM CHIP;0201)
R331  value 5.49  [RES-0402-N]  (hidden comment: 5.49 Ohms;.06W;1%;±200PPM;CHIP RES;0402)
R332  value 294  [RES-0402-N]  (hidden comment: 294 OHMS; 1%; .1W; 100PPM; FILM; CHIP; 0402)
R334  value 200  [RES-0402-N]  (hidden comment: 200 OHMS; 1%; .1W; 100PPM; FILM; CHIP; 0402)
R335  value 200  [RES-0402-N]  (hidden comment: 200 OHMS; 1%; .1W; 100PPM; FILM; CHIP; 0402)
R336  value 5.49  [RES-0402-N]  (hidden comment: 5.49 Ohms;.06W;1%;±200PPM;CHIP RES;0402)
R338  value 294  [RES-0402-N]  (hidden comment: 294 OHMS; 1%; .1W; 100PPM; FILM; CHIP; 0402)
R339  value 49.9  [RES-0402-N]  (hidden comment: 49.9 OHMS;.06W;1%;200PPM;FILM;CHIP;0402)
R340  value 50  [RES-0402-N]  (hidden comment: RES;50 OHM;CHIP;5%;250PPM;PART WRAP;0402)
R341  value 432  [RES-0402-N]  (hidden comment: 432 OHMS; 1%; .1W; 100PPM; FILM; CHIP; 0402)
R342  value 100  [RES-0201-N]  (hidden comment: 100 OHMS;.05W;1%;100PPM;FILM CHIP;0201)
R343  value 100  [RES-0201-N]  (hidden comment: 100 OHMS;.05W;1%;100PPM;FILM CHIP;0201)
R344  value 100  [RES-0201-N]  (hidden comment: 100 OHMS;.05W;1%;100PPM;FILM CHIP;0201)
R352  value 750  [RES-0402-N]  (hidden comment: 750 OHMS;.1W;1%;100PPM;FILM CHIP;0402)
R353  value 787  [RES-0402-N]  (hidden comment: 787 OHMS;.1W;1%;100PPM;FILM CHIP;0402)
R354  value 2K  [RES-0201-N]  (hidden comment: 2 KOHMS;.05W;1%;100PPM;FILM CHIP;0201)
R355  value 20  [RES-0402-N]  (hidden comment: 20 OHMS;.06W;1%;200PPM;FILM;CHIP;0402)
R356  value 27.4  [RES-0402-N]  (hidden comment: 27.4 OHMS;.06W;1%;200PPM;FILM;CHIP;0402)
R357  value 332  [RES-0402-N]  (hidden comment: 332 OHMS; 1%; .1W; 100PPM; FILM; CHIP)
R358  value 150  [RES-0402-N]  (hidden comment: 150 OHMS; 1%; .1W; 100PPM; FILM; CHIP; 0402)
R410  value 221  [RES-0201-N]  (hidden comment: 221 OHMS;.05W;1%;100PPM;FILM CHIP;0201)
R411  value 100  [RES-0201-N]  (hidden comment: 100 OHMS;.05W;1%;100PPM;FILM CHIP;0201)
R412  value 20  [RES-0402-N]  (hidden comment: 20 OHMS;.06W;1%;200PPM;FILM;CHIP;0402)
R415  value 10K  [RES-0201-N]  (hidden comment: 10 KOHMS;.05W;1%;100PPM;FILM CHIP;0201)
R419  value 750  [RES-0201-N]  (hidden comment: 750 OHMS;.05W;1%;100PPM;FILM CHIP;0201)
R420  value 6.04K  [RES-0402-N]  (hidden comment: 6.04K OHMS;.06W;1%;200PPM;FILM;CHIP;0402)
R421  value 15  [RES-0201-N]  (hidden comment: 15 OHMS;.05W;1%;200PPM;FILM CHIP;0201)
R422  value 1.27K  [RES-0201-N]  (hidden comment: 1.27 KOHMS;.05W;1%;100PPM;FILM CHIP;0201)
R423  value 15  [RES-0603-N]  (hidden comment: 15.0 OHMS;.06W;1%;200PPM;FILM;CHIP;0603)
R424  value 750  [RES-0201-N]  (hidden comment: 750 OHMS;.05W;1%;100PPM;FILM CHIP;0201)
R425  value 20  [RES-0201-N]  (hidden comment: 20 OHMS;.05W;1%;200PPM;FILM CHIP;0201)
R426  value 1.00K  [RES-0402-N]  (hidden comment: 1.0K OHMS;.06W;1%;200PPM;FILM;CHIP;0402)
R427  value 100  [RES-0201-N]  (hidden comment: 100 OHMS;.05W;1%;100PPM;FILM CHIP;0201)
R428  value 432  [RES-0402-N]  (hidden comment: 432 OHMS; 1%; .1W; 100PPM; FILM; CHIP; 0402)
R450  value 16.2  [RES-0402-N]  (hidden comment: 16.2 OHMS;.06W;1%;200PPM;FILM;CHIP;0402)
R451  value 309  [RES-0402-N]  (hidden comment: 309 OHMS; 1%; .1W; 100PPM; FILM; CHIP; 0402)
R452  value 76.8  [RES-0402-N]  (hidden comment: 76.8 OHMS;.06W;1%;200PPM;FILM;CHIP;0402)
R453  value 113  [RES-0402-N]  (hidden comment: 113 OHMS; 1%; .1W; 100PPM; FILM; CHIP; 0402)
R454  value 76.8  [RES-0402-N]  (hidden comment: 76.8 OHMS;.06W;1%;200PPM;FILM;CHIP;0402)
R455  value 51.1  [RES-2010-N]  (hidden comment: 51.1 OHM;.75W;1%;100PPM;FILM CHIP;2010)
R682  value 100  [RES-0201-N]  (hidden comment: 100 OHMS;.05W;1%;100PPM;FILM CHIP;0201)
R776  value 1.00K  [RES-0402-N]  (hidden comment: 1.0K OHMS;.06W;1%;200PPM;FILM;CHIP;0402)
R777  value 150  [RES-0402-N]  (hidden comment: 150 OHMS; 1%; .1W; 100PPM; FILM; CHIP; 0402)
R778  value 1.00K  [RES-0402-N]  (hidden comment: 1.0K OHMS;.06W;1%;200PPM;FILM;CHIP;0402)
R779  value 2.00K  [RES-0402-N]  (hidden comment: 2.00K OHMS;.06W;1%;200PPM;FILM;CHIP;0402)
R1269  value 200  [RES-0402-N]  (hidden comment: 200 OHMS; 1%; .1W; 100PPM; FILM; CHIP; 0402)
R1337  value 47.5  [RES-0402-N]  (hidden comment: 47.5 OHMS;.06W;1%;200PPM;FILM;CHIP;0402)
SW1  QUAD SPST ANALOG SW;200NS;45 OHM;SO-16  [SOIC-16_Vishay]  (value not drawn)
TP2  TEST TERMINAL;CHIP TYPE;SMT;063 X.031 X.045  [TP-RCU]  (value not drawn)
U41  M74VHC1GT32DFT1G SGL OR SOT-353 RoHS  [SOT-353_ONSEMI]  (value not drawn)
U44  OP AMP;350-MHz Low-Noise Voltage-Feedback Amplifier, Dual  [SOIC65P490X110-9P]  (value not drawn)  (parts A,B of 2)
U46  M_PN: AD9748  [QFN50P500X500X100-33V2N]  (hidden comment: AD9748 8-Bit, 210 MSPS, DIFF OUTPUT CURRENT, Tx DAC, 3.3V, SMT 32 pin LFCSP PKG)
U73  OSCILLATOR;VCO;MMIC;6-12GHz,+1dBm OUT;5V SUP;0-23V TUNE;4X4mm LC-24 W/BOT PAD  [QFN-24_HITTITE_LC4B_047]  (value not drawn)
U74  OP AMP;DUAL;CURRENT FDBK;2GHZ;+15V SUP;115MA OUT;MSOP-8 W/BOT PAD  [SOIC65P490X110-9P]  (value not drawn)  (parts A,B of 2)
U75  UID0-00439  [QS16G_HITTITE]
U86  PRESCALER;2-BIT PROG;0.2-2GHz;-2/10dBm IN;10dBm O;3X3 mm LP-16 W/BOT PAD  [QFN-16_HITTITE_LP3]  (value not drawn)
U87  PRESCALER;DIVIDE-BY-8 TO F11;0-14GHz;-3.3V SUP;-16/10dBm IN;4dBm O;6X6mm QFN-40  [QFN50P600X600X100-40N]  (value not drawn)
U88  RESISTIVE SPLITTER;6 DB;+/-.5DB;0-20 GHZ;.098x.098x.020  [RES SPLITTER]  (value not drawn)
U119  M_PN: SGA6289Z  [SOT-89]  (hidden comment: AMP;0-4500MHZ;20DB;+13DBM;5V;75MA;4.0DB NF;SOT-89)
U167  OP AMP;1.8NV/HZ;0.7UV/C MAX;125UV OFFSET MAX;SOT-23-5;RoHS  [SOT23-5_ANALOG]  (value not drawn)
X3  XFORMER;1:4Z CT;500-2500MHZ; .25W;30MA;.15INx.15IN  [AT224-1]  (value not drawn)
X4  XFORMER;1:4Z CT;1.5-600 MHZ; .25W;30MA;DB714 CASE  [CPLR-DB714]  (value not drawn)

### Ports
1200MHz_PLL, A1_PLL_DAC_0, A1_PLL_DAC_1, A1_PLL_DAC_2, A1_PLL_DAC_3, A1_PLL_DAC_4, A1_PLL_DAC_5, A1_PLL_DAC_6, A1_PLL_DAC_7, A1_PLL_DAC_CLK, PLL_A_-3.3, PLL_B_-3.3, PLL_C_-3.3, PLL_D_-3.3, PLL_E_-3.3, PLL_F_-3.3, VCO_OUT

### Nets
+3.3V_vco: C32.2 C43.1 C92.2 C98.2 C99.1 C225.1 C226.2 C470.2 C471.1 FL20.1(IN) FL26.1(IN) FT27.1 L22.2 L45.2 L119.1
+5V_VCC: C27.1 C313.2 C315.2 C412.1 C416.1 C417.1 C468.2 C469.1 FL19.1(IN) FL135.3(OUT) FL251.3(OUT) FL254.3(OUT) FT13.1 R777.1
+6V_vco: C1238.2 Q3.3(COLLECTOR)
+8V_vco: C321.1 C322.1 C409.2 C411.1 C460.1 C1209.1 FL240.3(OUT) FL250.1(IN) FT29.1 U167.5(V+)
+12V_VCO: C31.2 C242.1 C304.2 C305.1 FL180.3(OUT) FL252.3(OUT) FT3.1
+15V_VCO: C272.1 C273.1 C465.1 C466.1 FL14.1(IN) FL169.3(OUT) FT2.1
-3.3_vco: C279.1 C281.1 C289.1 FL198.1(IN)
-5V_VCO: C68.2 C75.2 L21.2
-7V_VCO: C328.1 C331.1 FL242.3(OUT)
GND: AT20.2(GND) AT21.2(GND) C22.2 C23.2 C26.2 C27.2 C30.2 C31.1 C32.1 C42.1 C43.2 C44.2 C68.1 C75.1 C92.1 C98.1 C99.2 C127.2 C161.1 C167.2 C168.1 C169.2 C170.2 C219.1 C220.1 C221.1 C223.2 C224.2 C225.2 C226.1 C228.1 C229.2 C242.2 C243.1 C247.1 C248.1 C249.1 C250.1 C262.1 C263.1 C264.2 C265.1 C266.2 C267.1 C268.1 C269.2 C270.2 C271.2 C272.2 C273.2 C274.1 C275.1 C276.1 C277.1 C279.2 C280.1 C281.2 C282.1 C283.1 C284.1 C285.1 C286.2 C287.2 C288.2 C289.2 C290.1 C291.1 C292.1 C293.1 C296.1 C297.1 C298.1 C299.1 C300.2 C302.2 C304.1 C305.2 C306.1 C307.1 C308.1 C309.1 C310.1 C311.1 C312.1 C313.1 C314.1 C315.1 C316.1 C317.1 C318.2 C319.2 C320.2 C321.2 C322.2 C323.1 C325.2 C326.2 C327.2 C328.2 C329.1 C330.1 C331.2 C362.1 C363.1 C364.2 C383.2 C384.2 C386.2 C404.1 C405.2 C406.1 C407.1 C408.1 C409.1 C410.2 C411.2 C412.2 C413.2 C414.2 C415.2 C416.2 C417.2 C442.2 C443.2 C444.2 C455.2 C456.2 C457.2 C458.2 C459.2 C460.2 C461.2 C462.2 C463.2 C464.2 C465.2 C466.2 C467.2 C468.1 C469.2 C470.1 C471.2 C1209.2 C1210.2 C1211.2(NEG) C1212.2(NEG) C1213.1 C1238.1 C1239.2 FL14.2(GND) FL19.2(GND) FL20.2(GND) FL26.2(GND) FL135.2(GND) FL136.2 FL139.2 FL140.2(GND) FL154.2(GND) FL160.2(GND) FL167.2(GND) FL169.2(GND) FL178.2 FL179.2(GND) FL180.2(GND) FL181.2(GND) FL182.2(GND) FL183.2 FL191.2(GND) FL192.2(GND) FL195.2(GND) FL197.2(GND) FL198.2(GND) FL199.2 FL200.2 FL201.2(GND) FL202.2(GND) FL203.2(GND) FL204.2(GND) FL205.2(GND) FL206.2(GND) FL207.2(GND) FL208.2(GND) FL209.2(GND) FL240.2(GND) FL241.2(GND) FL242.2(GND) FL243.2 FL246.2(GND) FL246.4(GND) FL247.2(GND) FL247.4(GND) FL248.2(GND) FL249.2(GND) FL250.2(GND) FL251.2(GND) FL252.2(GND) FL253.2(GND) FL254.2(GND) FL255.2(GND) FL295.2(GND) L31.1 L32.1 L33.1 L34.1 L35.1 L36.1 L37.1 L38.1 L145.1 L146.1 MTG35.MH MTG62.MH MTG63.MH MTG64.MH MTG65.MH MTG66.MH MTG73.MH MTG78.MH MTG79.MH MTG96.MH MTG103#2.MH MTG109.MH MTG117.MH MTG118.MH MTG119.MH MTG120.MH MTG121.MH MTG122.MH MTG123.MH MTG124.MH MTG125.MH MTG126.MH MTG127.MH MTG128.MH MTG129.MH MTG130.MH MTG131.MH MTG132.MH MTG133.MH MTG134.MH MTG135.MH MTG136.MH MTG137.MH MTG138.MH MTG139.MH MTG140.MH MTG141.MH MTG142.MH MTG143.MH MTG144.MH MTG145.MH MTG146.MH MTG173.MH MTG174.MH MTG175.MH MTG176.MH MTG177.MH R56.1 R63.1 R254.2 R332.1 R338.1 R339.1 R340.1 R354.1 R355.2 R411.2 R415.1 R419.2 R451.2 R452.2 R454.2 R779.1 SW1.5(G) U41.3(GND) U44.5(IN+) U46.10(DCOM) U46.14(CLKCOM) U46.15(CMODE) U46.16(MODE) U46.19(ACOM) U46.22(ACOM) U46.26(DCOM) U46.33(G) U73.1(NC) U73.2(NC) U73.3(NC) U73.5(NC) U73.6(NC) U73.7(NC) U73.8(NC) U73.9(NC) U73.10(NC) U73.11(NC) U73.13(NC) U73.14(GND) U73.16(NC) U73.17(NC) U73.18(NC) U73.19(NC) U73.20(NC) U73.21(NC) U73.22(NC) U73.23(NC) U73.24(NC) U73.25(GND) U74.4(V-) U74.9(V-) U75.2(GND) U75.8(GND) U75.9(GND) U75.11(GND) U75.16(GND) U75.17(GND) U86.4(GND) U86.7(CTRL) U86.13(BIAS1) U86.17(GND) U87.1(VCC) U87.6(VCC) U87.11(VCC) U87.17(VCC) U87.18(VCC) U87.19(VCC) U87.20(VCC) U87.23(VCC) U87.24(VCC) U87.25(VCC) U87.26(VCC) U87.27(VCC) U87.28(VCC) U87.29(VCC) U87.41(VCC) U119.2(GND) U119.4(GND) U167.2(V-) X3.4(Pri)
300_MHz_VCO: C278.2 R288.1 R332.2
+12V_U44: C413.1 FL252.1(IN) R353.1 R422.1
A1_PLL_DAC_CLK: FL160.1(IN) U41.1(B) U41.2(A) ; port A1_PLL_DAC_CLK
Dac_Clock_0-5V: R108.2 R177.2 SW1.1(IN1) SW1.9(IN3) SW1.16(IN2)
VCO_OUT: AT20.1(IN/OUT) ; port VCO_OUT
VEE: C286.1 C287.1 C288.1 C383.1 C384.1 C386.1 C442.1 C443.1 C444.1 C455.1 C456.1 C457.1 C458.1 C459.1 L136.2 R342.1 R343.1 R344.1 U87.2(VEE) U87.3(VEE) U87.7(VEE) U87.8(VEE) U87.9(VEE) U87.10(VEE) U87.12(VEE) U87.13(VEE) U87.14(VEE) U87.21(VEE) U87.22(VEE) U87.30(VEE) U87.40(VEE)
VT: C174.2 L255.1 R352.1 R420.1 U74.1(OUT)
VT_SAMPLE: R425.2 TP2.1
NetAT20_3: AT20.3(IN/OUT) U88.3
NetAT21_1: AT21.1(IN/OUT) U88.2
NetAT21_3: AT21.3(IN/OUT) C295.1
NetC22_1: C22.1 C23.1 C44.1 C243.2 C461.1 C462.1 C463.1 C464.1 L44.2 R270.2 R271.2 R334.2 R335.2 R1269.2 U75.1(VCC)
NetC26_1: C26.1 FL199.3 FL253.1(IN)
NetC30_1: C30.1 FL181.1(IN) L40.1
NetC33_1: C33.1 C41.2 C332.2 C334.1 L143.2 L144.1
NetC33_2: C33.2 C34.1 C334.2 C335.1 L23.1 L144.2
NetC34_2: C34.2 C35.1 C56.2 C57.2 C335.2 C336.1 C337.1 L23.2 L24.1
NetC35_2: C35.2 C36.1 C45.1 C336.2 L24.2 L25.1
NetC36_2: C36.2 C37.1 C45.2 C46.1 L25.2 L26.1
NetC37_2: C37.2 C38.1 C46.2 C47.1 C52.1 C58.2 C338.2 L26.2 L27.1
NetC38_2: C38.2 C39.1 C47.2 C48.1 L27.2 L28.1
NetC39_2: C39.2 C40.1 C48.2 C49.1 L28.2 L29.1
NetC40_2: C40.2 C49.2 C50.1 C53.1 C54.1 C333.1 C339.2 L29.2 L30.1
NetC41_1: C41.1 C332.1 L143.1 R276.2
NetC42_2: C42.2 C167.1 FL179.1(IN) L173.1
NetC50_2: C50.2 C55.1 C333.2 L30.2 U73.4(GND)
NetC52_2: C52.2 L34.2
NetC53_2: C53.2 L37.2
NetC54_2: C54.2 L146.2
NetC55_2: C55.2 L145.2
NetC56_1: C56.1 L32.2
NetC57_1: C57.1 L33.2
NetC58_1: C58.1 L35.2
NetC127_1: C127.1 C314.2 FL135.1(IN) U41.5(VCC)
NetC161_2: C161.2 C168.2 C323.2 C404.2 C405.1 L40.2 R287.2 R427.2 R682.2 U86.1(VCC) U86.5(B0) U86.6(B1) U86.15(EN)
NetC163_1: C163.1 U119.1(IN)
NetC163_2: C163.2 R254.1 R450.2
NetC169_1: C169.1 C248.2 C1239.1 FL154.1(IN) L120.2
NetC170_1: C170.1 FL179.3(OUT) FL180.1(IN)
NetC174_1: C174.1 R1337.2
NetC219_2: C219.2 R274.1 R329.1 R334.1 U75.14(NU)
NetC220_2: C220.2 R285.1 R330.1 R335.1 U75.12(ND)
NetC221_2: C221.2 U46.23(REFIO)
NetC223_1: C223.1 C1210.1 C1212.1(POS) FL195.3(OUT) Q3.2(EMITTER) R778.2 R779.2
NetC224_1: C224.1 FL195.1(IN) L39.2
NetC228_2: C228.2 U86.16(CBIAS)
NetC229_1: C229.1 FL154.3(OUT) L39.1
NetC244_1: C244.1 U75.4(NR)
NetC244_2: C244.2 R336.1 R341.2
NetC246_1: C246.1 U75.3(R)
NetC246_2: C246.2 R331.1 R341.1
NetC247_2: C247.2 L129.1 L130.2
NetC249_2: C249.2 L120.1 L121.2
NetC250_2: C250.2 L121.1 L129.2
NetC251_1: C251.1 R340.2
NetC251_2: C251.2 U87.5(INP)
NetC262_2: C262.2 C265.2 C268.2 L49.1 R272.2
NetC263_2: C263.2 C267.2 C269.1 FL140.1(IN) U74.8(V+)
NetC264_1: C264.1 C274.2 L130.1 U73.12(VCC)
NetC266_1: C266.1 X4.2(SecCT)
NetC270_1: C270.1 FL140.3(OUT) L50.1
NetC271_1: C271.1 FL169.1(IN) L50.2
NetC275_2: C275.2 C276.2 C277.2 L131.1 R273.1
NetC278_1: C278.1 U75.6(V)
NetC280_2: C280.2 U75.7(NV)
NetC282_2: C282.2 C302.1 FL255.3(OUT) L133.1
NetC283_2: C283.2 L133.2 L135.1
NetC284_2: C284.2 L134.1 L135.2
NetC285_2: C285.2 L134.2 L136.1
NetC290_2: C290.2 C293.2 L137.1 SW1.4(V-)
NetC291_2: C291.2 C292.2 L132.2 SW1.13(V+)
NetC294_1: C294.1 U87.15(OUTP)
NetC294_2: C294.2 R288.2 R338.2
NetC295_2: C295.2 U87.4(INN)
NetC296_2: C296.2 C297.2 L139.2 SW1.12(VL)
NetC298_2: C298.2 C299.2 L163.1 SW1.11(S3)
NetC300_1: C300.1 FL198.3(OUT) FL255.1(IN)
NetC303_1: C303.1 R339.2
NetC303_2: C303.2 U87.16(OUTN)
NetC306_2: C306.2 C309.2 C311.2 C312.2 R16.1 U46.3(DVDD) U46.11(CLKVDD)
NetC307_2: C307.2 C308.2 FL26.3(OUT) R16.2 U46.17(AVDD) U46.18(AVDD)
NetC310_2: C310.2 U46.13(CLK-)
NetC316_2: C316.2 C317.2 C318.1 FL201.1(IN) U44.8(V+)
NetC319_1: C319.1 FL201.3(OUT) R185.1
NetC320_1: C320.1 FL240.1(IN) R185.2
NetC325_1: C325.1 C329.2 C330.2 FL241.1(IN) U44.4(V-) U44.9(V-)
NetC326_1: C326.1 FL241.3(OUT) L142.1
NetC327_1: C327.1 FL242.1(IN) L142.2
NetC337_2: C337.2 L31.2
NetC338_1: C338.1 L36.2
NetC339_1: C339.1 L38.2
NetC362_2: C362.2 C363.2 L140.1 SW1.6(S4)
NetC364_1: C364.1 X3.2(Sec_CT)
NetC397_1: C397.1 X3.3(Sec_Dot)
NetC397_2: C397.2 U86.3(RFINN)
NetC406_2: C406.2 FL248.1(IN) FL249.1(IN)
NetC407_2: C407.2 C410.1 FL248.3(OUT) R455.1
NetC408_2: C408.2 FL249.3(OUT) FL250.3(OUT)
NetC414_1: C414.1 FL181.3(OUT) FL251.1(IN)
NetC415_1: C415.1 FL253.3(OUT) FL254.1(IN)
NetC418_1: C418.1 FL247.1(IN)
NetC418_2: C418.2 L172.1 U119.3(OUT)
NetC467_1: C467.1 FL14.3(OUT) R174.1
NetC830_1: C830.1 R56.2 R410.2 R412.2 U44.6(IN-)
NetC830_2: C830.2 R357.2 R410.1 U44.7(OUT)
NetC1101_1: C1101.1 X3.1(Sec)
NetC1101_2: C1101.2 U86.2(RFINP)
NetC1208_1: C1208.1 R778.1 U167.4(IN-)
NetC1208_2: C1208.2 R776.1 U167.1(OUT)
NetC1211_1: C1211.1(POS) C1213.2 Q3.1(BASE) R776.2
NetCR20_1: CR20.1(A) CR20.2(K) R286.1 R426.1 SW1.15(D2)
NetCR20_3: CR20.3(A) R358.1 R426.2
NetFL19_3: FL19.3(OUT) FL178.1
NetFL20_3: FL20.3(OUT) FL243.3
NetFL136_1: FL136.1 L49.2
NetFL136_3: FL136.3 L45.1
NetFL139_1: FL139.1 L131.2
NetFL139_3: FL139.3 L119.2
NetFL160_3: FL160.3(OUT) U46.12(CLK+)
NetFL167_1: FL167.1(IN) ; port A1_PLL_DAC_7
NetFL167_3: FL167.3(OUT) U46.27(DB7)
NetFL178_3: FL178.3 R175.1
NetFL182_1: FL182.1(IN) ; port A1_PLL_DAC_6
NetFL182_3: FL182.3(OUT) U46.28(DB6)
NetFL183_1: FL183.1 L137.2
NetFL183_3: FL183.3 L21.1
NetFL191_1: FL191.1(IN) ; port A1_PLL_DAC_4
NetFL191_3: FL191.3(OUT) U46.30(DB4)
NetFL192_1: FL192.1(IN) ; port A1_PLL_DAC_3
NetFL192_3: FL192.3(OUT) U46.31(DB3)
NetFL197_1: FL197.1(IN) ; port A1_PLL_DAC_0
NetFL197_3: FL197.3(OUT) U46.2(DB0)
NetFL199_1: FL199.1 L44.1
NetFL200_1: FL200.1 L140.2
NetFL200_3: FL200.3 L22.1
NetFL202_1: FL202.1(IN) ; port PLL_F_-3.3
NetFL202_3: FL202.3(OUT) U87.34(P5)
NetFL203_1: FL203.1(IN) ; port PLL_E_-3.3
NetFL203_3: FL203.3(OUT) U87.35(P4)
NetFL204_1: FL204.1(IN) ; port PLL_D_-3.3
NetFL204_3: FL204.3(OUT) U87.36(P3)
NetFL205_1: FL205.1(IN) ; port PLL_C_-3.3
NetFL205_3: FL205.3(OUT) U87.37(P2)
NetFL206_1: FL206.1(IN) ; port PLL_B_-3.3
NetFL206_3: FL206.3(OUT) U87.38(P1)
NetFL207_1: FL207.1(IN) ; port PLL_A_-3.3
NetFL207_3: FL207.3(OUT) U87.39(P0)
NetFL208_1: FL208.1(IN) ; port A1_PLL_DAC_1
NetFL208_3: FL208.3(OUT) U46.1(DB1)
NetFL209_1: FL209.1(IN) ; port A1_PLL_DAC_2
NetFL209_3: FL209.3(OUT) U46.32(DB2)
NetFL243_1: FL243.1 R176.1
NetFL246_1: FL246.1(IN) ; port 1200MHz_PLL
NetFL246_3: FL246.3(OUT) R450.1 R451.1
NetFL247_3: FL247.3(OUT) R453.1 R454.1
NetFL295_1: FL295.1(IN) ; port A1_PLL_DAC_5
NetFL295_3: FL295.3(OUT) U46.29(DB5)
NetL132_1: L132.1 R174.2
NetL139_1: L139.1 R175.2
NetL163_2: L163.2 R176.2
NetL172_2: L172.2 R455.2
NetL173_2: L173.2 R329.2 R330.2
NetL255_2: L255.2 R276.1
NetR63_2: R63.2 R287.1 U86.14(BIAS0)
NetR108_1: R108.1 U41.4(Y)
NetR172_1: R172.1 R173.1
NetR172_2: R172.2 R286.2 R1337.1
NetR173_2: R173.2 SW1.7(D4)
NetR177_1: R177.1 SW1.8(IN4)
NetR270_1: R270.1 U75.15(U)
NetR271_1: R271.1 U75.13(D)
NetR272_1: R272.1 R274.2 U74.5(IN+)
NetR273_2: R273.2 U74.3(IN+)
NetR280_1: R280.1 SW1.3(S1) SW1.14(S2)
NetR280_2: R280.2 U74.2(IN-)
NetR285_2: R285.2 R290.2 U74.6(IN-)
NetR290_1: R290.1 R358.2 U74.7(OUT)
NetR331_2: R331.2 R428.1 X4.4(Sec-)
NetR336_2: R336.2 R428.2 X4.6(Sec+)
NetR342_2: R342.2 U87.31(P8)
NetR343_2: R343.2 U87.33(P6)
NetR344_2: R344.2 U87.32(P7)
NetR352_2: R352.2 R356.2 R357.1 SW1.2(D1) SW1.10(D3)
NetR353_2: R353.2 R356.1
NetR354_2: R354.2 U46.24(FS_ADJ)
NetR355_1: R355.1 U46.20(IOUTB)
NetR411_1: R411.1 R423.2 R424.1 U44.2(IN-)
NetR412_1: R412.1 U46.21(IOUTA)
NetR415_2: R415.2 U46.25(SLEEP)
NetR419_1: R419.1 R421.2 U44.3(IN+)
NetR420_2: R420.2 R421.1
NetR422_2: R422.2 R423.1
NetR424_2: R424.2 R425.1 U44.1(OUT)
NetR427_1: R427.1 U86.10(IOUTN) X4.1(Pri+)
NetR452_1: R452.1 R453.2 X3.6(Pri_Dot)
NetR682_1: R682.1 U86.11(IOUTP) X4.3(Pri-)
NetR777_2: R777.2 U167.3(IN+)
NetR1269_1: R1269.1 U75.10(VCC3V)
NetU73_15: U73.15(RFOUT) U88.1

Not connected (* = marked no-connect by the designer): U46 4(NC) 5(NC) 6(NC) 7(NC) 8(NC) 9(NC); U75 5(NC); U86 8(N/C) 9(N/C) 12(N/C)

### Layout directives
net class 50_mil_Clearance: NetC33_1, NetC33_2, NetC34_2, NetC35_2, NetC36_2, NetC37_2, NetC38_2, NetC39_2, NetC40_2, NetC41_1, NetC50_2, NetC52_2, NetC53_2, NetC54_2, NetC55_2, NetC56_1, NetC57_1, NetC58_1, NetC337_2, NetC338_1, NetC339_1
net class GCPW Clearance: NetAT21_1, NetFL246_1
net class 30 mil clearance: NetC163_1, NetC163_2, NetC244_2, NetC246_2, NetC397_1, NetC397_2, NetC418_1, NetC418_2, NetC1101_1, NetC1101_2, NetFL246_3, NetFL247_3, NetR331_2, NetR336_2, NetR427_1, NetR452_1, NetR682_1

### Notes on the sheet
- FAST PHASE LOCKED LOOP
- 40mA
- 57mA
- (near U167) [datasheet] <http://www.analog.com/static/imported-files/data_sheets/ADA4004-1_4004-2_4004-4.pdf>
- (near C1101) 1.2 GHz
- (near R682) +10 dBm
- diff
- (near R427) 300 MHz
- (near U86) [datasheet] <http://www.hittite.com/products/view.html/view/HMC794LP3E>
- (near X4) IL=0.5 dB
- (near X3) +5 dBm
- IL=13.5 dB
- IL=3 dB
- (near U73) VCO
- +6.5dBm
- -5 dBm
- (near AT20) -5 dBm
- +18.5dBm
- (near U88) +1 dBm
- (near U88) IL=6 dB
- (near FL247) IL=0.5 dB
- +19dBm
- (near C163) +6dBm
- 3.3 V to 12.6 V
- (near U73) 7.5 to 10.5 GHz
- 4 to 12 V
- (near U119) G=13dB
- P1=18dBm
- [datasheet] <http://www.hittite.com/content/documents/data_sheet/hmc439qs16g.pdf>
- (near SW1) PLL
- (near SW1) DAC
- VT = 3.3 + Idac*R410*R352/R357
- IL=2.8 dB
- (near AT21) -15 dBm
- +8.8dBm
- (near FL246) IL=0.8 dB
- Dac Clock=L; SW2 ON; SW3 ON; SW1 OFF ;SW4 OFF
- Dac Clock=H; SW2 OFF; SW3 OFF; SW1 ON ;SW4 ON
- CENTELLAX DIVIDER
- +9.6dBm
- 0 mA to 12.43 mA
- 10.68 mA to 23.11 mA
- 3.3 V
- (near U44) -3.84 V to 0 V
- 10.68 mA
- IL=3dB
- (near FL202) -3.3V - 0V
- -3.3V - 0V
- 75mA
- (near FL204) -3.3V - 0V
- (near R412) I_fs = 19.2 mA
- V_refio = 1.2V
- 0 mA to 19.2 mA
- VCO: 7.5 to 10.5 GHz, 4 to 12 V
- (near FL206) -3.3V - 0V
- I_fs = 32*V_refio/R354
- I_fs = 19.2 mA
- (near U46) DAC
- 0V - 3.3V
- (near FL167) 0V - 3.3V
- 0V - 5V
- (near FL295) 0V - 3.3V
- VT - 7 V
- 10.68 mA ??
- (near FL192) 0V - 3.3V
- NOTES UNLESS OTHERWISE SPECIFIED:
  1. CAPACITOR VALUES ARE IN uF
  2. RESISTOR VALUES ARE IN OHMS
- Title
- Sheet Title
- PRINTED DOCUMENT IS CONSIDERED UNCONTROLLED. VERIFY REVISION IN PLM SYSTEM.
- THIS DOCUMENT CONTAINS PROPRIETARY INFORMATION. DESIGN RIGHTS BELONG TO GIGA-TRONICS AND MAY NOT BE REPRODUCED WITHOUT WRITTEN AUTHORIZATION FOR ANY REASON EXCEPT CALIBRATION, OPERATION AND MAINTENANCE.
- Size
- CAGE CODE
- Filename
- D
- Document Number
- 58900
- Date
- Sheet
- Rev
- of
- (in symbol LFS0-00222) ,
- (in symbol LFS0-00250) ,